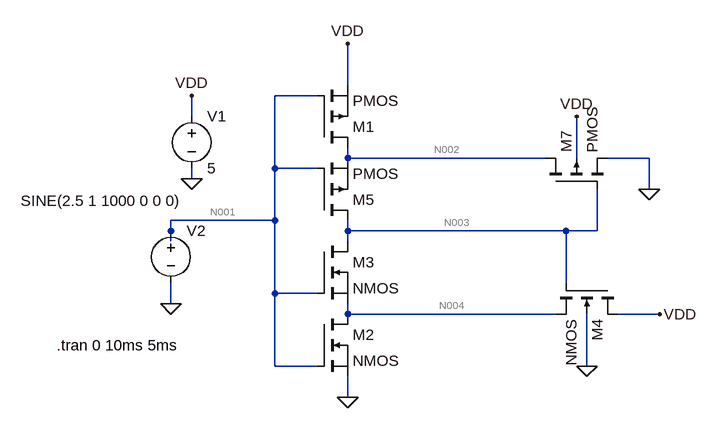
[diagram p0: schematic cmos_sch_trig.asc]
cmos_sch_trig.asc, the LTspice schematic file:
Version 4
SHEET 1 880 680
WIRE 272 -48 272 -112
WIRE 224 -32 160 -32
WIRE 32 0 32 -32
WIRE 272 64 272 48
WIRE 576 64 272 64
WIRE 624 64 624 0
WIRE 736 64 672 64
WIRE 160 80 160 -32
WIRE 224 80 160 80
WIRE 32 96 32 80
WIRE 736 112 736 64
WIRE 160 160 160 80
WIRE 160 160 0 160
WIRE 0 176 0 160
WIRE 272 176 272 160
WIRE 608 176 272 176
WIRE 656 176 656 112
WIRE 656 176 608 176
WIRE 0 192 0 176
WIRE 272 192 272 176
WIRE 608 256 608 176
WIRE 160 272 160 160
WIRE 224 272 160 272
WIRE 0 288 0 256
WIRE 272 304 272 288
WIRE 592 304 272 304
WIRE 752 304 688 304
WIRE 160 384 160 272
WIRE 224 384 160 384
WIRE 640 384 640 304
WIRE 272 432 272 400
FLAG 272 432 0
FLAG 272 -112 VDD
FLAG 736 112 0
FLAG 752 304 VDD
FLAG 32 96 0
FLAG 32 -32 VDD
FLAG 0 288 0
FLAG 624 0 VDD
FLAG 640 384 0
SYMBOL pmos 224 48 M180
SYMATTR InstName M1
SYMBOL nmos 224 304 R0
SYMATTR InstName M2
SYMBOL nmos 224 192 R0
SYMATTR InstName M3
SYMBOL pmos 224 160 M180
SYMATTR InstName M5
SYMBOL voltage 32 -16 R0
WINDOW 123 0 0 Left 0
WINDOW 39 0 0 Left 0
SYMATTR InstName V1
SYMATTR Value 5
SYMBOL voltage 0 160 R0
WINDOW 3 -231 -30 Left 2
WINDOW 123 0 0 Left 0
WINDOW 39 0 0 Left 0
SYMATTR Value SINE(2.5 1 1000 0 0 0)
SYMATTR InstName V2
SYMBOL pmos4 576 112 R270
SYMATTR InstName M7
SYMBOL nmos4 688 256 R90
SYMATTR InstName M4
TEXT -176 352 Left 2 !.tran 0 10ms 5ms

The netlist it stands for:
* cmos_sch_trig.asc
M1 N002 N001 VDD VDD PMOS
M2 N004 N001 0 0 NMOS
M3 N003 N001 N004 N004 NMOS
M5 N003 N001 N002 N002 PMOS
V1 VDD 0 5
V2 N001 0 SINE(2.5 1 1000 0 0 0)
M7 N002 N003 0 VDD PMOS
M4 VDD N003 N004 0 NMOS
.model NMOS NMOS
.model PMOS PMOS
.lib standard.mos
.tran 0 10ms 5ms
.backanno
.end

* Results of the author's LTspice run, read from the files saved beside the schematic
* Operating Point, zero values left out:
*   V(n002) = 3.943 V
*   V(n001) = 2.5 V
*   V(vdd) = 5 V
*   V(n004) = 1.057 V
*   V(n003) = 2.5 V
*   Id(M1) = -41.67 µA
*   Ib(M1) = 1.067 pA
*   Is(M1) = 41.67 µA
*   Id(M5) = -20.83 µA
*   Ib(M5) = 1.453 pA
*   Is(M5) = 20.83 µA
*   Id(M7) = 20.83 µA
*   Ib(M7) = 6.077 pA
*   Is(M7) = -20.83 µA
*   Id(M2) = 41.67 µA
*   Ib(M2) = -1.067 pA
*   Is(M2) = -41.67 µA
*   Id(M3) = 20.83 µA
*   Ib(M3) = -1.453 pA
*   Is(M3) = -20.83 µA
*   Id(M4) = 20.83 µA
*   Ib(M4) = -6.077 pA
*   Is(M4) = -20.83 µA
*   I(V1) = -62.5 µA
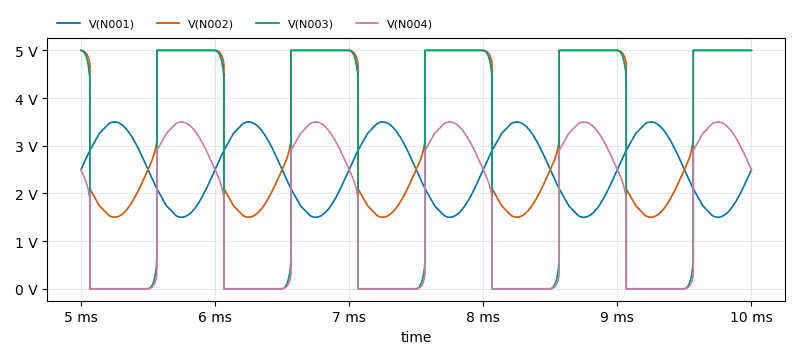
[diagram p1: Transient Analysis of cmos_sch_trig.asc, plotted from the saved traces]
* Transient Analysis, 1 run:
*   V(N001): min 1.5 V, max 3.5 V, average 2.5 V, rms 2.598 V, last 2.5 V
*   V(N002): min 1.501 V, max 5 V, average 3.459 V, rms 3.794 V, last 5 V
*   V(N003): min 0 V, max 5 V, average 2.5 V, rms 3.522 V, last 5 V
*   V(N004): min 0 V, max 3.499 V, average 1.541 V, rms 2.193 V, last 2.5 V